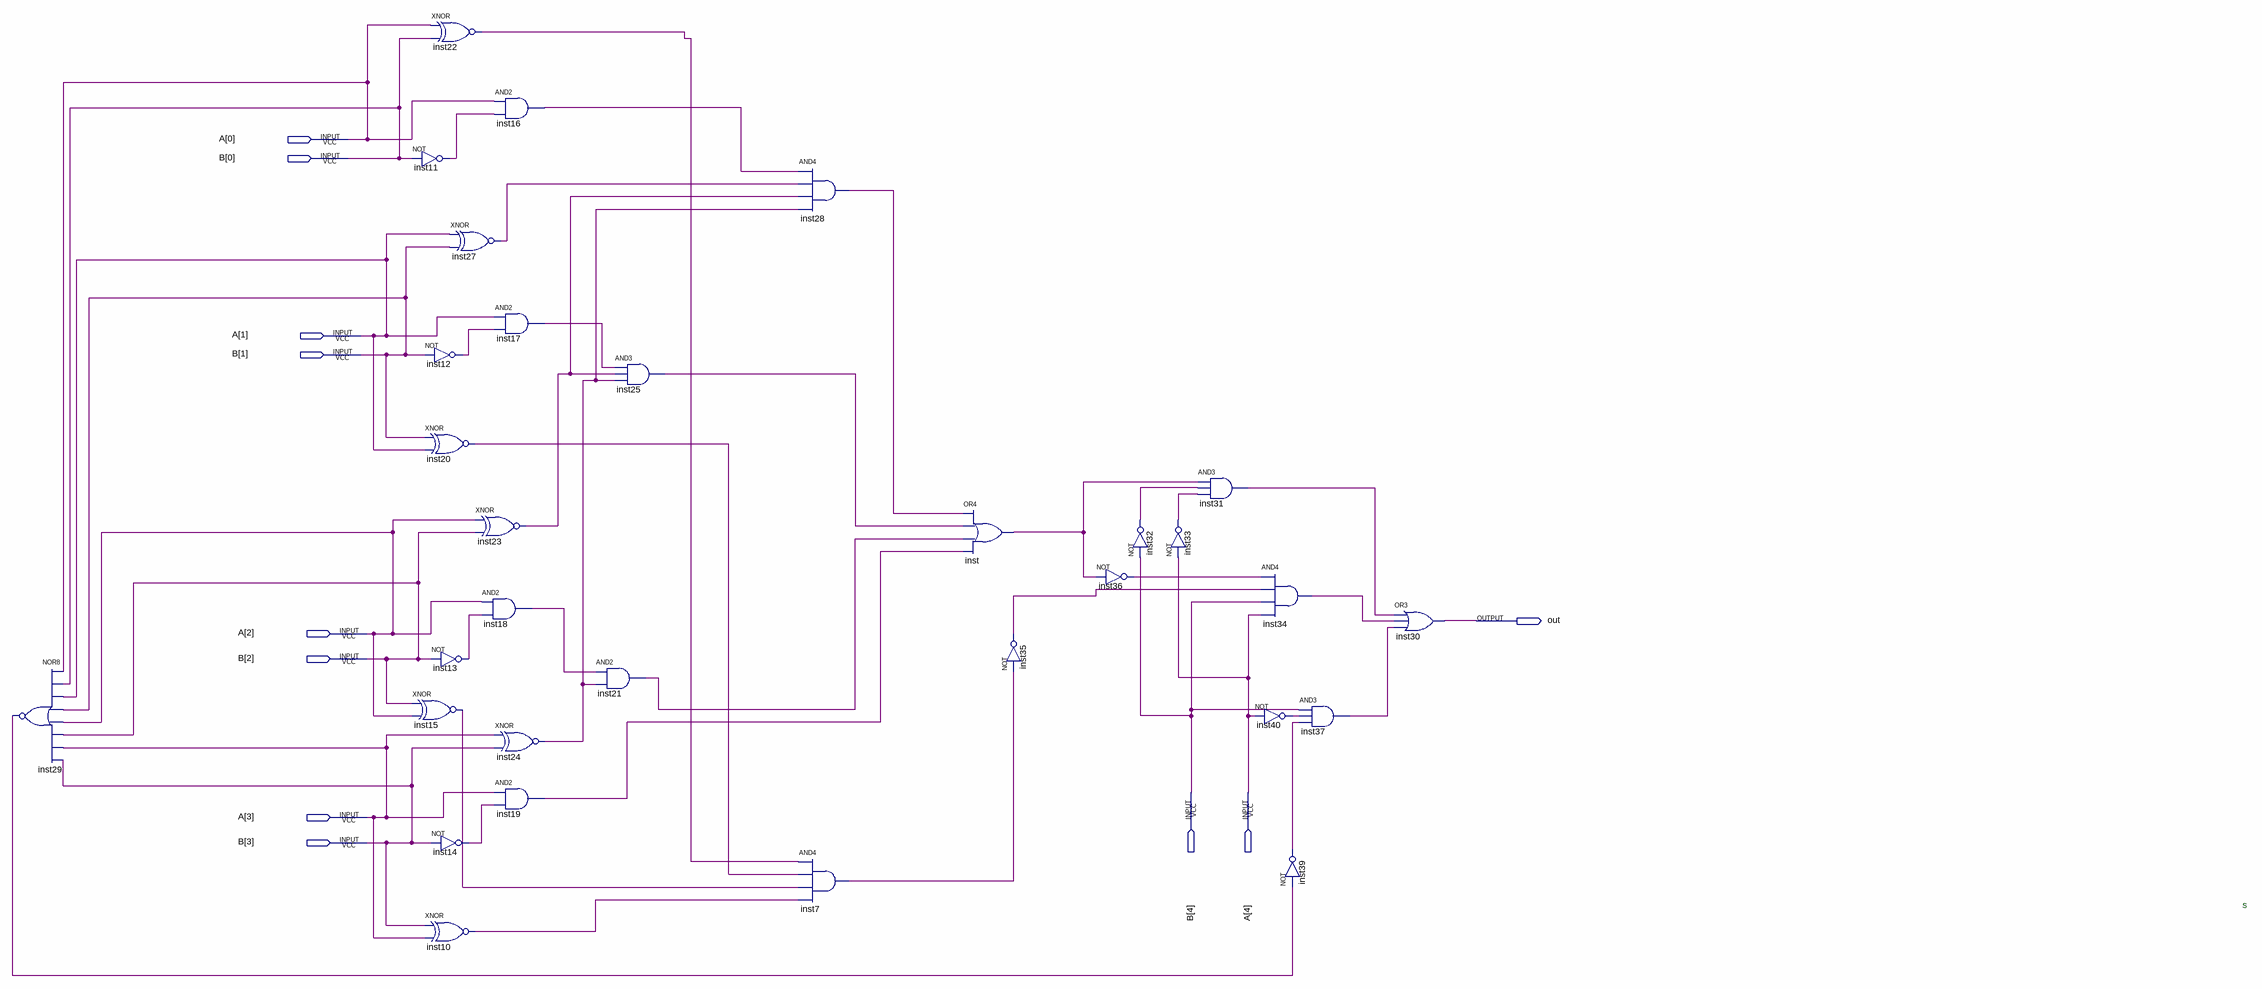
[diagram p0: schematic sheet]
// Quartus schematic AMaiorQueB.bdf as structural Verilog: 31 symbols, 11 pins
module AMaiorQueB (
  input  [4:0] A,
  input  [4:0] B,
  output out
);

  wire inst7_out, inst10_out, inst11_out, inst12_out, inst13_out, inst14_out, inst15_out, inst16_out,
       inst17_out, inst18_out, inst19_out, inst20_out, inst21_out, inst22_out, inst23_out, inst24_out,
       inst25_out, inst27_out, inst28_out, inst29_out, inst31_out, inst32_out, inst33_out, inst34_out,
       inst35_out, inst36_out, inst37_out, inst39_out, inst40_out, inst_out;

  nor inst29 (inst29_out, A[0], B[0], A[1], B[1], A[2], B[2], A[3], B[3]);
  xnor inst22 (inst22_out, A[0], B[0]);
  not inst11 (inst11_out, B[0]);
  not inst12 (inst12_out, B[1]);
  xnor inst20 (inst20_out, B[1], A[1]);
  not inst13 (inst13_out, B[2]);
  xnor inst15 (inst15_out, B[2], A[2]);
  not inst14 (inst14_out, B[3]);
  xnor inst10 (inst10_out, B[3], A[3]);
  and inst16 (inst16_out, A[0], inst11_out);
  xnor inst27 (inst27_out, A[1], B[1]);
  and inst17 (inst17_out, A[1], inst12_out);
  xnor inst23 (inst23_out, A[2], B[2]);
  and inst18 (inst18_out, A[2], inst13_out);
  xnor inst24 (inst24_out, A[3], B[3]);
  and inst19 (inst19_out, A[3], inst14_out);
  and inst21 (inst21_out, inst18_out, inst24_out);
  and inst25 (inst25_out, inst17_out, inst23_out, inst24_out);
  and inst28 (inst28_out, inst16_out, inst27_out, inst23_out, inst24_out);
  and inst7 (inst7_out, inst22_out, inst20_out, inst15_out, inst10_out);
  or inst (inst_out, inst28_out, inst25_out, inst21_out, inst19_out);
  not inst35 (inst35_out, inst7_out);
  not inst36 (inst36_out, inst_out);
  not inst32 (inst32_out, B[4]);
  and inst31 (inst31_out, inst_out, inst32_out, inst33_out);
  not inst33 (inst33_out, A[4]);
  not inst40 (inst40_out, A[4]);
  and inst34 (inst34_out, inst36_out, inst35_out, B[4], A[4]);
  and inst37 (inst37_out, B[4], inst40_out, inst39_out);
  not inst39 (inst39_out, inst29_out);
  or inst30 (out, inst31_out, inst34_out, inst37_out);

  // Notes on the sheet:
  //   s
endmodule
